# EAGLE design sensors_board (EAGLE 9.1.0)
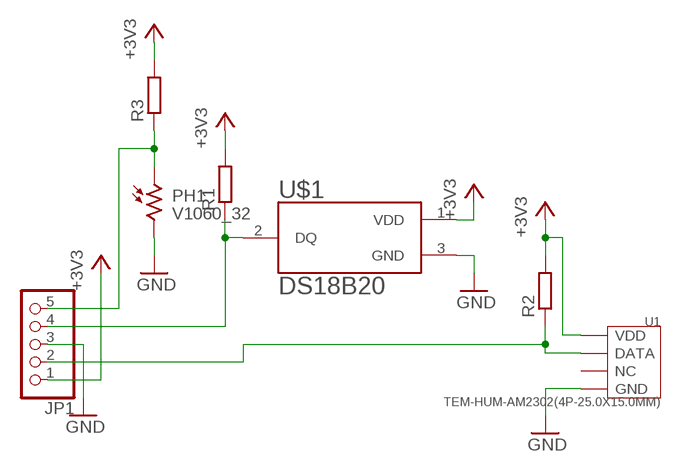
[diagram p0: schematic, sheet 1]

## Parts
JP1  PINHD-1X5/90  [1X05/90]
PH1  V1060_32  [TO-5_V10]
R1  R-EU_R1206  [R1206]
R2  R-EU_R1206  [R1206]
R3  R-EU_R1206  [R1206]
U1  TEM-HUM-AM2302(4P-25.0X15.0MM)  [SNR4-2.54-25.0X15.0X7.0MM]
U$1  DS18B20  [TO92-]

## Nets
+3V3: JP1.1 R1.2 R2.2 R3.2 U1.P$1(VDD) U$1.1(VDD)
GND: JP1.3 PH1.2 U1.P$4(GND) U$1.3(GND)
N$1: JP1.2 R2.1 U1.P$2(DATA)
N$2: JP1.4 R1.1 U$1.2(DQ)
N$3: JP1.5 PH1.1 R3.1
Unconnected: U1.P$3(NC)

## Library data of the parts
JP1 = pinhead:PINHD-1X5: PIN HEADER
PH1 = photo-elements:?1060*: Sensor Street Light control Source: http://optoelectronics.perkinelmer.com/content/Datasheets/DTS_PhotocellsB1060.pdf
R1-R3 = rcl:R-EU_: RESISTOR, European symbol; SPICEPREFIX: R
U1 = TEM-HUM-AM2302_4P-25.0X15.0MM_:TEM-HUM-AM2302(4P-25.0X15.0MM): 314010001; AVAILABILITY: Unavailable; DESCRIPTION: DHT22 Temp / Humidity Sensor DHT22 Temp / Humidity Sensor; MF: MCM Electronics; MP: AM2302; PACKAGE: None; PRICE: None
U$1 = DS18B20_PAR:DS18B20

## Board
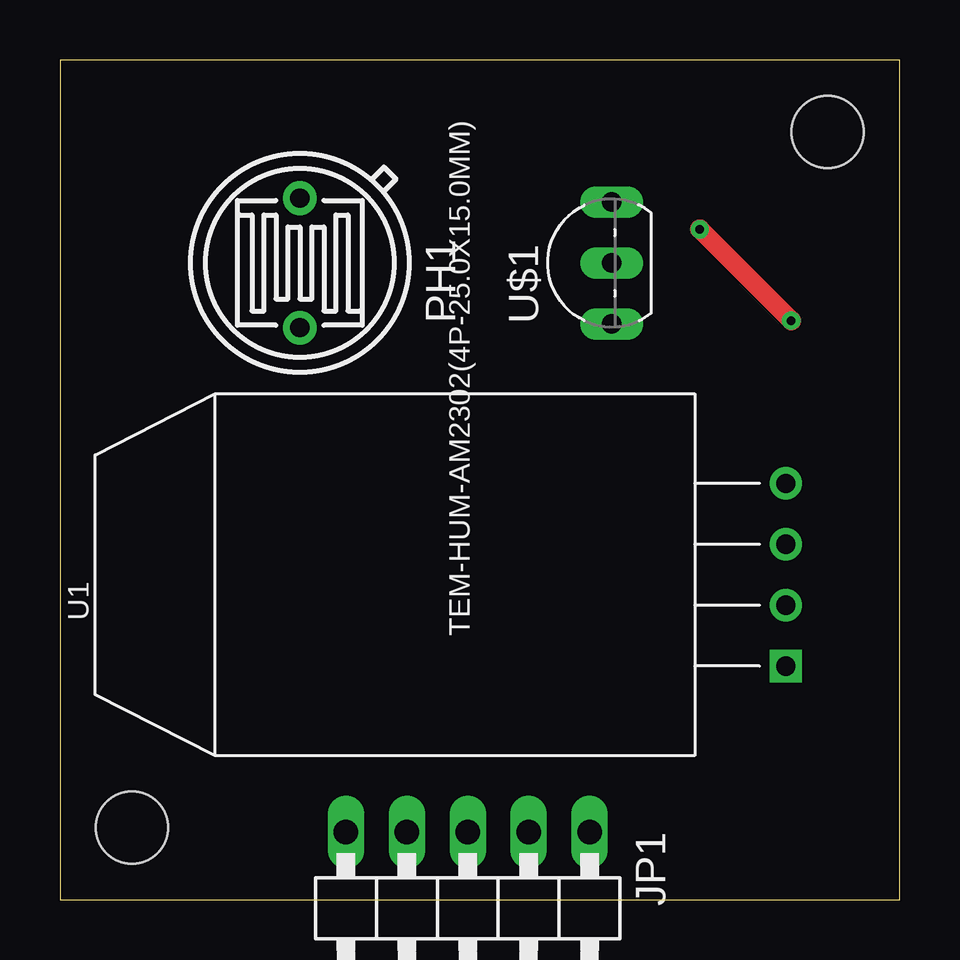
[diagram p1: board, top side]
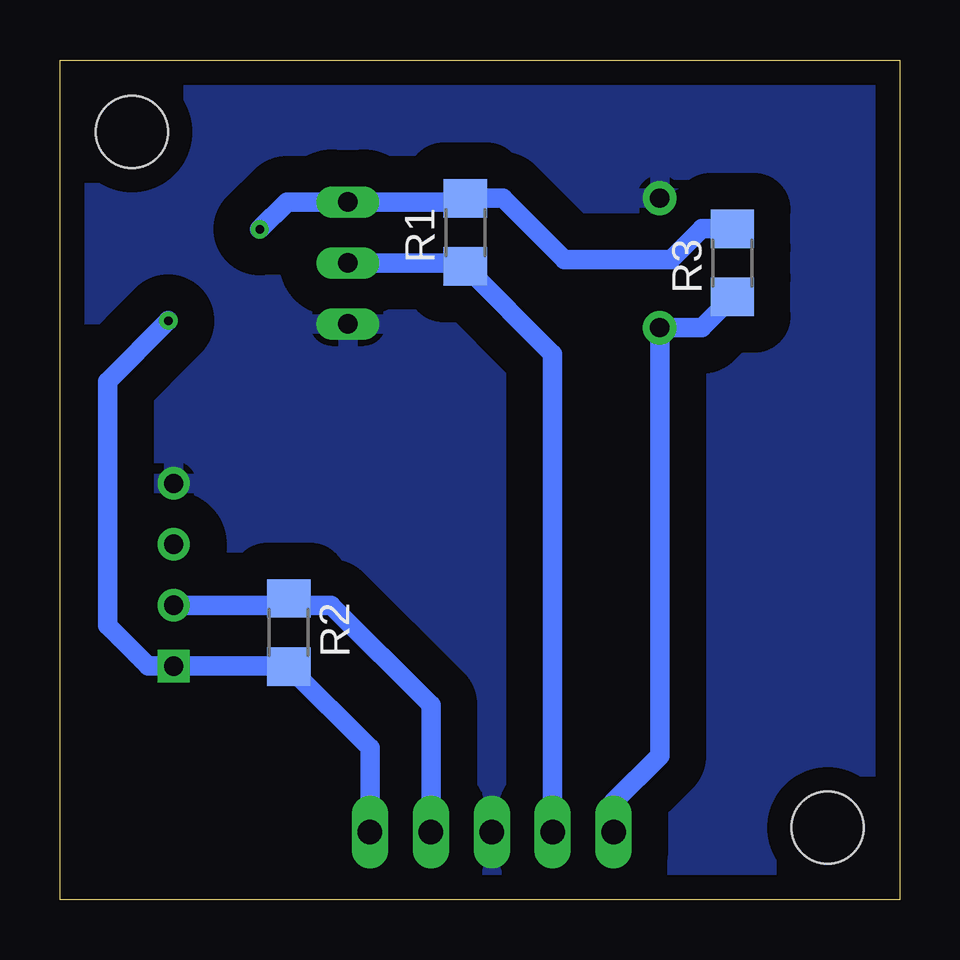
[diagram p2: board, bottom side, seen from below]

Size 35 x 35 mm. Coordinates in mm from the lower left corner, seen from the top.
Outline: 0,0 35,0 35,35 0,35 0,0
Copper layers (1*16): Top 0.035mm / dielectric 1.5mm / Bottom 0.035mm
Design rules "default *": minimum track width 6mil, minimum drill 0.35mm, track to track 60mil, track to pad 20mil, pad to pad 6mil, via to via 6mil, smd to smd 6mil, copper to edge 40mil, drill to drill 6mil, minimum pad ring 10mil, minimum via ring 8mil, stop-mask expansion 4mil, vias tented up to drill 0mil, thermal gap 10mil
Holes 3 mm at 3,3 32,32

### Footprints (pad centres in the part's own frame; a part is rotated, then mirrored left to right if it is on the bottom)
1X05/90 = drill 1.016 long: 1 -5.08,-3.81; 2 -2.54,-3.81; 3 0,-3.81; 4 2.54,-3.81; 5 5.08,-3.81
TO-5_V10 = drill 0.8 pad 1.4: 1 -2.7,0; 2 2.7,0
R1206 = smd 1.6 x 1.803: 1 -1.422,0; 2 1.422,0
SNR4-2.54-25.0X15.0X7.0MM = drill 0.8 pad 1.35 square: P$1 -3.81,-13.8 | drill 0.8 pad 1.35: P$2 -1.27,-13.8; P$3 1.27,-13.8; P$4 3.81,-13.8
TO92- = drill 0.813 long: 1 2.54,0; 2 0,0; 3 -2.54,0

### Placement (x,y rotation side)
JP1  17,-1 180 top
PH1  10,26.54 90 top
R1  18.1,27.81 90 bottom
R2  25.46,11.13 270 bottom
R3  6.97,26.54 90 bottom
U1  16.46,13.54 90 top
U$1  23,26.54 90 top

### Tracks (layer width: path | path; a pad name or v marks a point on that pad's centre or on a via)
+3V3  (via drill 0.35)
  Top 0.813: v30.48,24.13 v26.67,27.94
  Bottom 0.813: R2.2 25.4,9.65 | R2.2 25.48,9.73 U1.P$1 31.32,9.73 33.02,11.43 33.02,21.59 v30.48,24.13 | JP1.1 22.08,6.33 R2.2 | v26.67,27.94 25.53,29.08 U$1.1 18.25,29.08 R1.2 16.53,29.23 13.97,26.67 9.53,26.67 8.24,27.96 R3.2
GND
  pour Bottom: 0,0 35,0 35,35 0,35
N$1
  Bottom 0.813: U1.P$2 25.74,12.27 | 25.74,12.27 R2.1 | JP1.2 19.54,8.11 23.7,12.27 25.74,12.27
N$2
  Bottom 0.813: JP1.4 14.46,22.75 R1.1 18.25,26.54 U$1.2
N$3
  Bottom 0.813: R3.1 8.25,23.84 PH1.1 10,6 11.92,4.08 JP1.5